# EasyEDA Pro project ProPrj_24王起源U202442553_2025-12-01.epro

# Schematic AI-Light原理图
Board Name: AI-Light; Create Date: 2025-11-24; Page Name: P1; Project Name: 24王起源U202442553; Schematic Name: AI-Light原理图; Update Date: 2025-11-24; Company: 嘉立创EDA; Page Size: A4; Version: V1.0
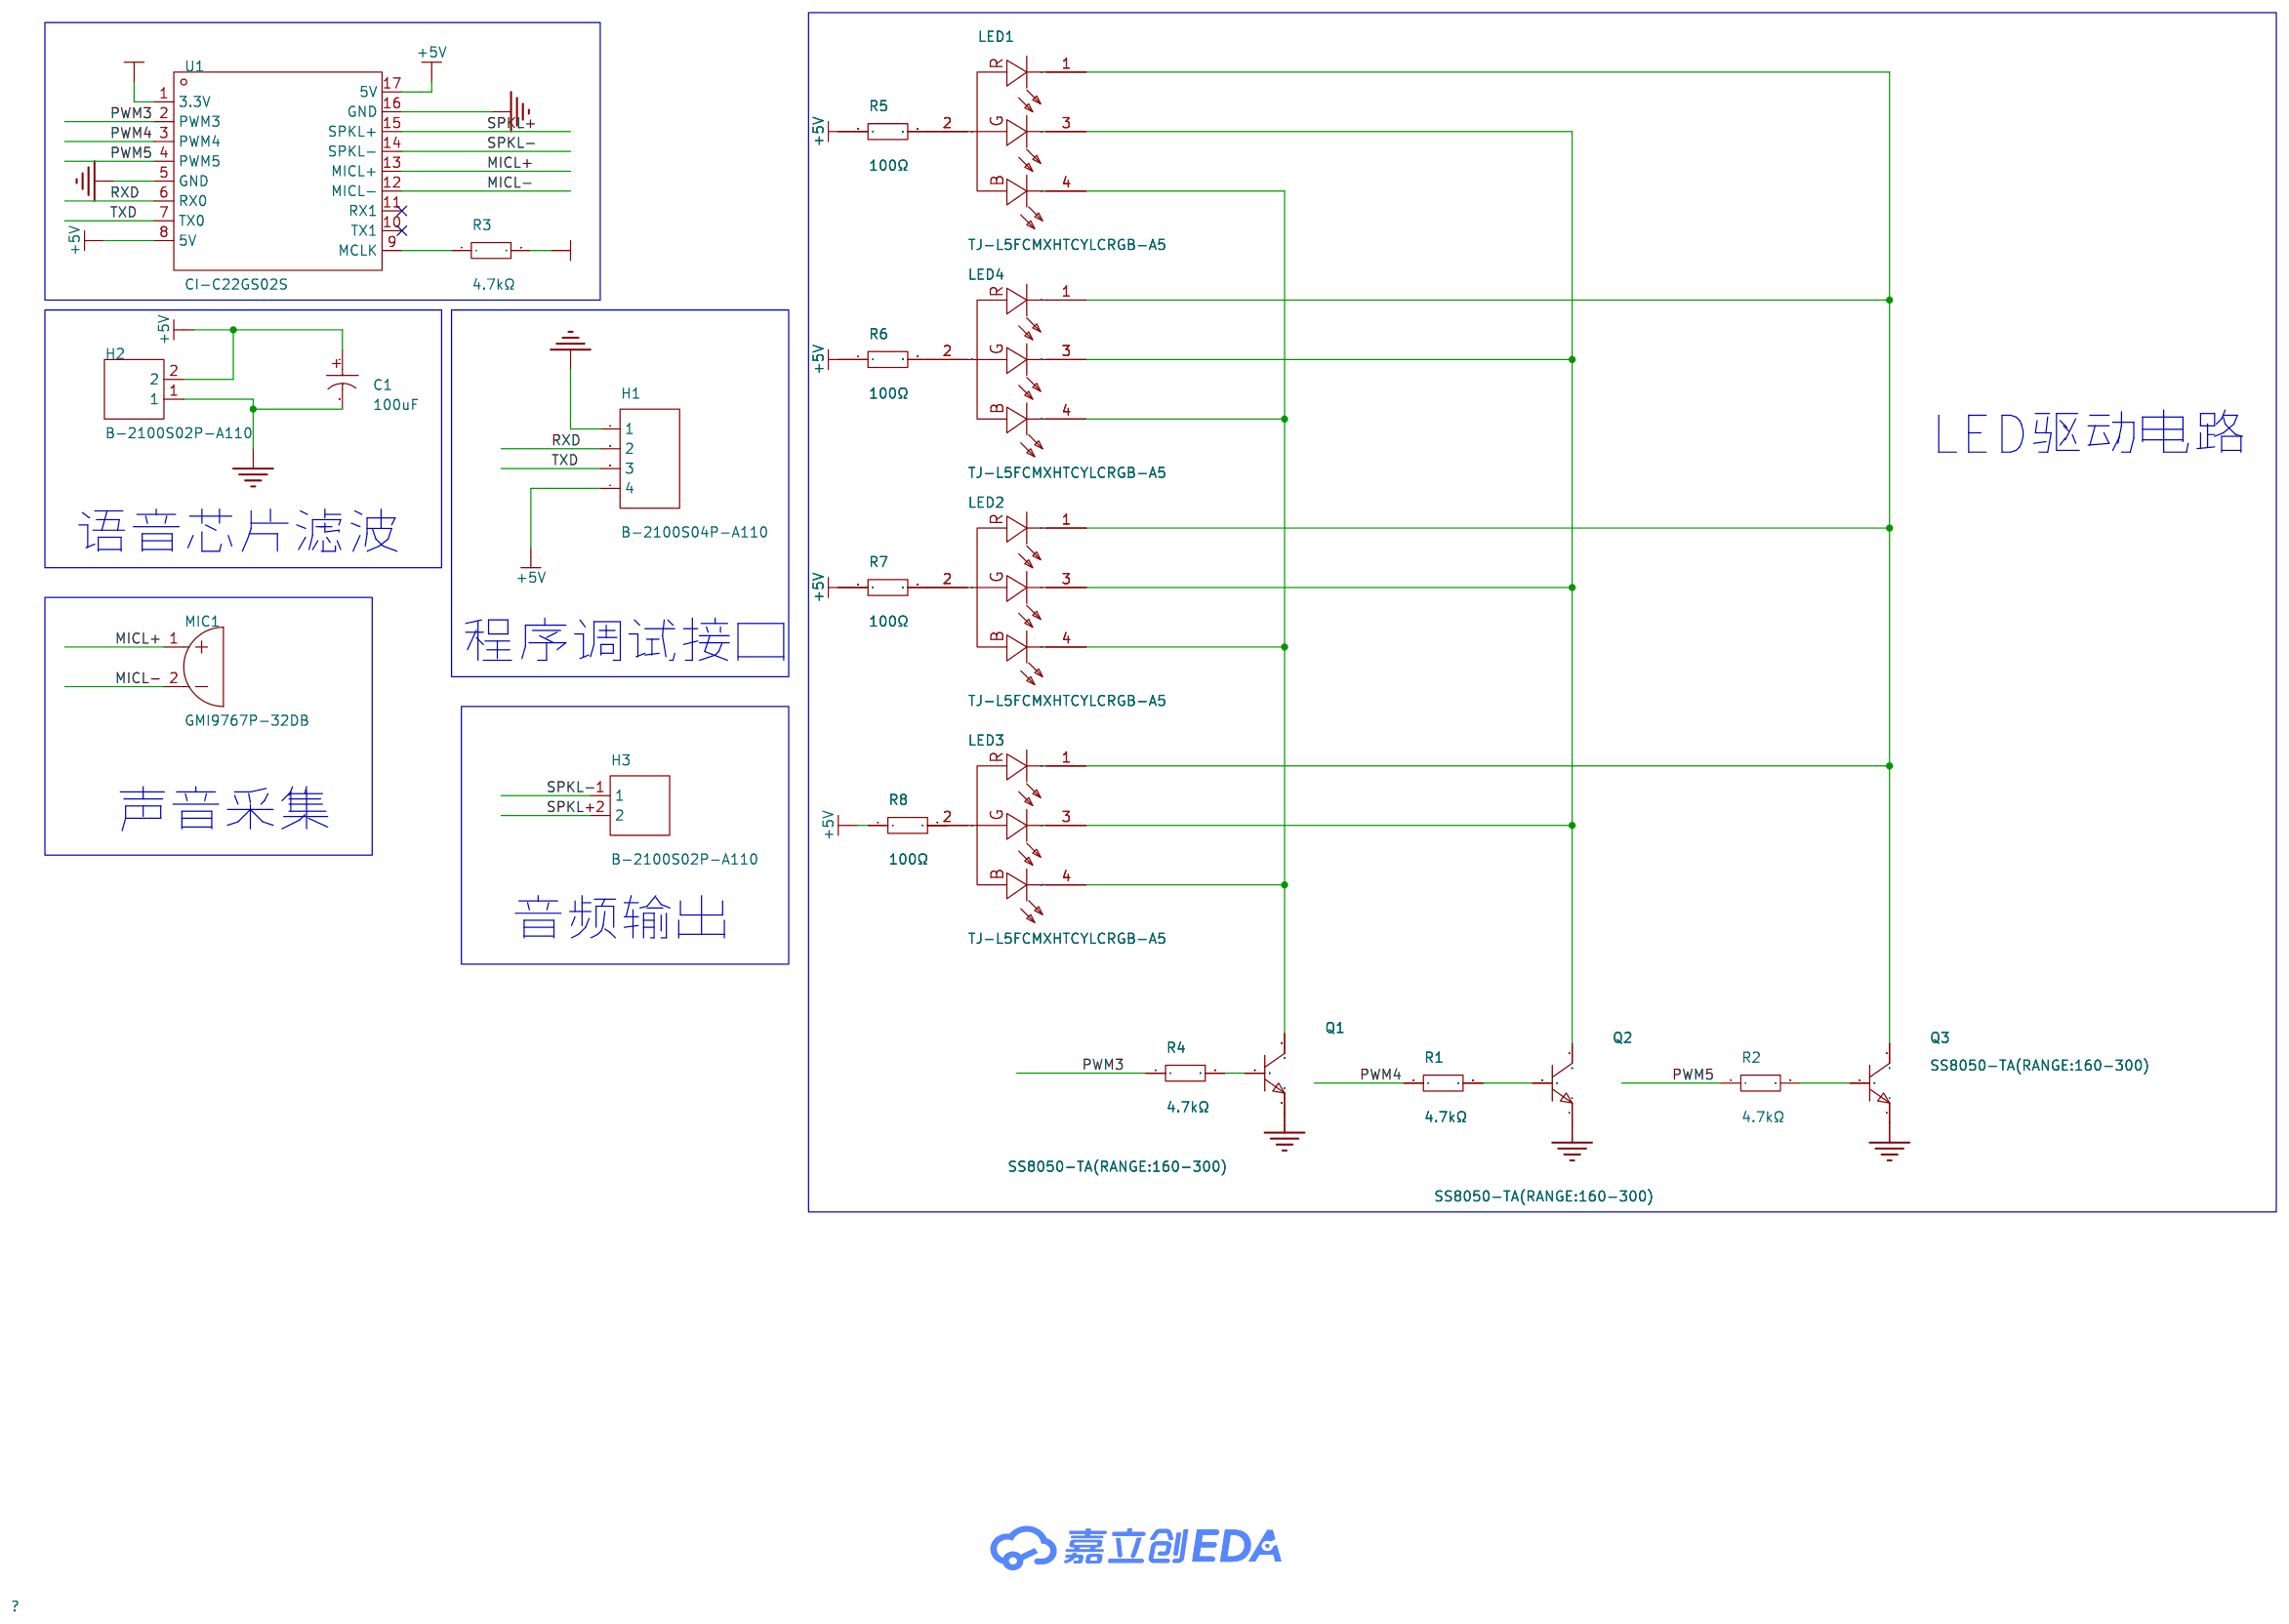
[diagram p0: schematic sheet]

## Parts
C1  100uF  [CAP-TH_BD5.0-P2.00-D0.8-FD]
H1  B-2100S04P-A110  [HDR-TH_4P-P2.54-V-M]
H2  B-2100S02P-A110  [HDR-TH_2P-P2.54-V-M-1]
H3  B-2100S02P-A110  [HDR-TH_2P-P2.54-V-M-1]
LED1  TJ-L5FCMXHTCYLCRGB-A5  [LED-TH_4P-BD5.8-P1.30]
LED2  TJ-L5FCMXHTCYLCRGB-A5  [LED-TH_4P-BD5.8-P1.30]
LED3  TJ-L5FCMXHTCYLCRGB-A5  [LED-TH_4P-BD5.8-P1.30]
LED4  TJ-L5FCMXHTCYLCRGB-A5  [LED-TH_4P-BD5.8-P1.30]
MIC1  GMI9767P-32DB  [MIC-TH_BD9.7-P2.54-D0.8-L-FD]
Q1  SS8050-TA(RANGE:160-300)  [TO-92-3_L4.8-W3.7-P2.54-L]
Q2  SS8050-TA(RANGE:160-300)  [TO-92-3_L4.8-W3.7-P2.54-L]
Q3  SS8050-TA(RANGE:160-300)  [TO-92-3_L4.8-W3.7-P2.54-L]
R1  4.7kΩ  [RES-TH_BD2.3-L6.5-P10.50-D0.5]
R2  4.7kΩ  [RES-TH_BD2.3-L6.5-P10.50-D0.5]
R3  4.7kΩ  [RES-TH_BD2.3-L6.5-P10.50-D0.5]
R4  4.7kΩ  [RES-TH_BD2.3-L6.5-P10.50-D0.5]
R5  100Ω  [RES-TH_BD3.3-L9.0-P13.00-D0.6]
R6  100Ω  [RES-TH_BD3.3-L9.0-P13.00-D0.6]
R7  100Ω  [RES-TH_BD3.3-L9.0-P13.00-D0.6]
R8  100Ω  [RES-TH_BD3.3-L9.0-P13.00-D0.6]
U1  CI-C22GS02S  [SMD-17_L20.0-W1.80-CI-C22GS02S]

## Library data of the parts
C1 = KM107M016D11RR0VH2FP0: 容值:100uF;精度:±20%;额定电压:16V;纹波电流:125mA@120Hz;等效串联电阻(ESR):-;; LCSC Part Name: 100uF ±20% 16V; Supplier Part: C43348; Manufacturer: Chengx(承兴); Supplier Footprint: 插件,D5xL11mm; JLCPCB Part Class: 扩展库; Datasheet: https://item.szlcsc.com/datasheet/KM107M016D11RR0VH2FP0/44339.html; Supplier: LCSC; Tolerance: ±20%; Voltage Rating: 16V; Ripple Current: 125mA@120Hz; Pin Spacing: 2mm; Diameter: 5mm; Height - Seated (Max): 11mm; Lifetime: 1000hrs@105℃
H1 = B-2100S04P-A110: 插针结构:1x4P;间距:2.54mm;行距:-;圆针/方针:-;安装方式:直插;排数:单排;总PIN位数:4P;额定电流:-;额定电压:-;配合针长度:6mm;塑高:2.54mm;端接针长度:3mm;触头材质:黄铜;触头镀层:-;工作温度:-40℃~+105℃;颜色:黑色;; LCSC Part Name: 1x4P 间距:2.54mm 直插; Supplier Part: C124378; Manufacturer: Ckmtw(灿科盟); Supplier Footprint: 插件,P=2.54mm; JLCPCB Part Class: 扩展库; Datasheet: https://item.szlcsc.com/datasheet/B-2100S04P-A110/125653.html; Supplier: LCSC; Pin Structure: 1x4P; Pitch: 2.54mm; Mounting Type: 直插; Number of Rows: 单排; Number of Pins: 4P; Length of Mating Pin: 6mm; Insulation Height: 2.54mm; Length of End Connection Pin: 3mm; Contact Material: 黄铜; Operating Temperature: -40℃~+105℃; Color: 黑色
H2 H3 = B-2100S02P-A110: 插针结构:1x2P;间距:2.54mm;行距:-;圆针/方针:-;安装方式:直插;排数:单排;总PIN位数:2P;额定电流:-;额定电压:-;配合针长度:6mm;塑高:2.54mm;端接针长度:3mm;触头材质:黄铜;触头镀层:-;工作温度:-40℃~+105℃;颜色:黑色;; LCSC Part Name: 1x2P 间距:2.54mm 直插; Supplier Part: C124375; Manufacturer: Ckmtw(灿科盟); Supplier Footprint: 插件,P=2.54mm; JLCPCB Part Class: 扩展库; Datasheet: https://item.szlcsc.com/datasheet/B-2100S02P-A110/125650.html; Supplier: LCSC; Pin Structure: 1x2P; Pitch: 2.54mm; Mounting Type: 直插; Number of Rows: 单排; Number of Pins: 2P; Length of Mating Pin: 6mm; Insulation Height: 2.54mm; Length of End Connection Pin: 3mm; Contact Material: 黄铜; Operating Temperature: -40℃~+105℃; Color: 黑色
LED1-LED4 = TJ-L5FCMXHTCYLCRGB-A5: F5草帽RGB,直插RGB,F5草帽三色RGB; LCSC Part Name: RGB三色; Supplier Part: C2837018; Manufacturer: TOGIALED(统佳); Supplier Footprint: 插件,D=5mm; JLCPCB Part Class: 扩展库; Datasheet: https://atta.szlcsc.com/upload/public/pdf/source/20210617/C2837018_8E26FA8363448FE2426644DEE2002080.pdf; Supplier: LCSC; Diode Configuration: 共阳极; Luminous Intensity: G:800mcd~1500mcd；B:200mcd~400mcd；R:200mcd~500mcd; Lens Color: 无色透明透镜; Forward Voltage: R:1.8V~2.4V；B:2.8V~3.4V；G:2.8V~3.4V; Operating Temperature: -20℃~+80℃
MIC1 = GMI9767P-32DB: 指向性:全指向;输出阻抗:2.2kΩ;信噪比:58dB;灵敏度:-32dB;; LCSC Part Name: 全指向φ9.7*6.7mm 1.5V-10V 灵敏度-32db 低阻抗 针脚; Supplier Part: C234013; Manufacturer: INGHAi(赢海); Supplier Footprint: 插件,D=9.7mm; JLCPCB Part Class: 扩展库; Datasheet: https://item.szlcsc.com/datasheet/GMI9767P-32DB/233795.html; Supplier: LCSC; Voltage - Supply: 4.5V; Current - Supply: 500uA; Direction: 全指向; Output Impedance: 2.2kΩ; S/N Ratio: 58dB; Sensitivity: -32dB; Diameter(φD): 9.7mm; Height: 6.7mm; Operating Temperature: -20℃~+60℃; Mounting Type: 插件
Q1-Q3 = SS8050-TA(RANGE:160-300): 晶体管类型:NPN;集电极电流(Ic):1.5A;集射极击穿电压(Vceo):25V;耗散功率(Pd):1W;直流电流增益(hFE):160@800mA,1V;; LCSC Part Name: hfe=160~300 NPN 电流:1.5A 电压:25V; Supplier Part: C80297; Manufacturer: CJ(江苏长电/长晶); Supplier Footprint: TO-92; JLCPCB Part Class: 扩展库; Datasheet: https://item.szlcsc.com/datasheet/SS8050-TA(RANGE%253A160-300)/81443.html; Supplier: LCSC; type: NPN; Current - Collector(Ic): 1.5A; Collector - Emitter Voltage VCEO: 25V; Pd - Power Dissipation: 1W; DC Current Gain: 160@800mA,1V; Transition frequency(fT): 100MHz; Current - Collector Cutoff: 100nA; Vce Saturation(VCE(sat)): 500mV; Operating Temperature: -55℃~+150℃
R1-R4 = MF1/4W-4.7KΩ±1% T: 电阻类型:金属膜电阻;阻值:4.7kΩ;精度:±1%;功率:250mW;温度系数:±100ppm/℃;; LCSC Part Name: 4.7kΩ ±1% 250mW 金属膜电阻 圆柱状直插; Supplier Part: C119339; Manufacturer: CCO(千志电子); Supplier Footprint: 插件,D2.3xL6.5mm; JLCPCB Part Class: 扩展库; Datasheet: https://item.szlcsc.com/datasheet/MF1%252F4W-4.7K%25CE%25A9%25C2%25B11%2525%2520T/120608.html; Supplier: LCSC; Type: 金属膜电阻; Tolerance: ±1%; Voltage-Supply(Max): 250V; Power(Watts): 250mW; Temperature Coefficient: ±100ppm/℃; Operating Temperature: -55℃~+155℃
R5-R8 = RN1/2W100ΩFT/BA1: 电阻类型:金属膜电阻;阻值:100Ω;精度:±1%;功率:500mW;温度系数:±50ppm/℃;; LCSC Part Name: 100Ω ±1% 500mW 金属膜电阻; Supplier Part: C385562; Manufacturer: Tyohm(幸亚电阻); Supplier Footprint: 插件,D3.3xL9.2mm; JLCPCB Part Class: 扩展库; Datasheet: https://item.szlcsc.com/datasheet/RN1%252F2W100%25CE%25A9FT%252FBA1/359409.html; Supplier: LCSC; Type: 金属膜电阻; Tolerance: ±1%; Voltage-Supply(Max): 350V; Power(Watts): 500mW; Temperature Coefficient: ±50ppm/℃
U1 = CI-C22GS02S: 长宽：18x20mm；带1路麦克风、1路喇叭和2路UART的接口、3路PWM接口。对外接口采用2排邮票孔和插针孔，方便采用回流贴片使用和焊接插针使用；支持离线语音识别（命令词条数：100条）; LCSC Part Name: CI1122单麦离线语音识别贴片模块; Supplier Part: C2759836; Manufacturer: Chiplntelli(启英泰伦); JLCPCB Part Class: 扩展库; Datasheet: https://item.szlcsc.com/datasheet/CI-C22GS02S/2879102.html; Supplier: LCSC

## Nets
3.3V: R3.2 U1.1(3.3V)
+5V: C1.1 H1.4 H2.2 R5.1 R6.1 R7.1 R8.1 U1.8(5V) U1.17(5V)
GND: C1.2 H1.1 H2.1 Q1.1(E) Q2.1(E) Q3.1(E) U1.5(GND) U1.16(GND)
MICL+: MIC1.1 U1.13(MICL+)
MICL-: MIC1.2 U1.12(MICL-)
PWM3: R4.1 U1.2(PWM3)
PWM4: R1.1 U1.3(PWM4)
PWM5: R2.1 U1.4(PWM5)
RXD: H1.2 U1.6(RX0)
SPKL+: H3.2 U1.15(SPKL+)
SPKL-: H3.1 U1.14(SPKL-)
TXD: H1.3 U1.7(TX0)
$1N639: LED1.2(CA) R5.2
$1N1634: R3.1 U1.9(MCLK)
$1N1900: LED4.2(CA) R6.2
$1N1902: LED2.2(CA) R7.2
$1N1904: LED3.2(CA) R8.2
$1N1908: Q1.2(B) R4.2
$1N1920: LED1.4(KB) LED2.4(KB) LED3.4(KB) LED4.4(KB) Q1.3(C)
$1N1972: Q2.2(B) R1.2
$1N2028: LED1.3(KG) LED2.3(KG) LED3.3(KG) LED4.3(KG) Q2.3(C)
$1N2078: Q3.2(B) R2.2
$1N2107: LED1.1(KR) LED2.1(KR) LED3.1(KR) LED4.1(KR) Q3.3(C)

Not connected (* = marked no-connect by the designer): U1 10(TX1)* 11(RX1)*

## Notes on the sheet
- LED驱动电路
- 语音芯片滤波
- 程序调试接口
- 声音采集
- 音频输出

# Board AI-Light-PCB
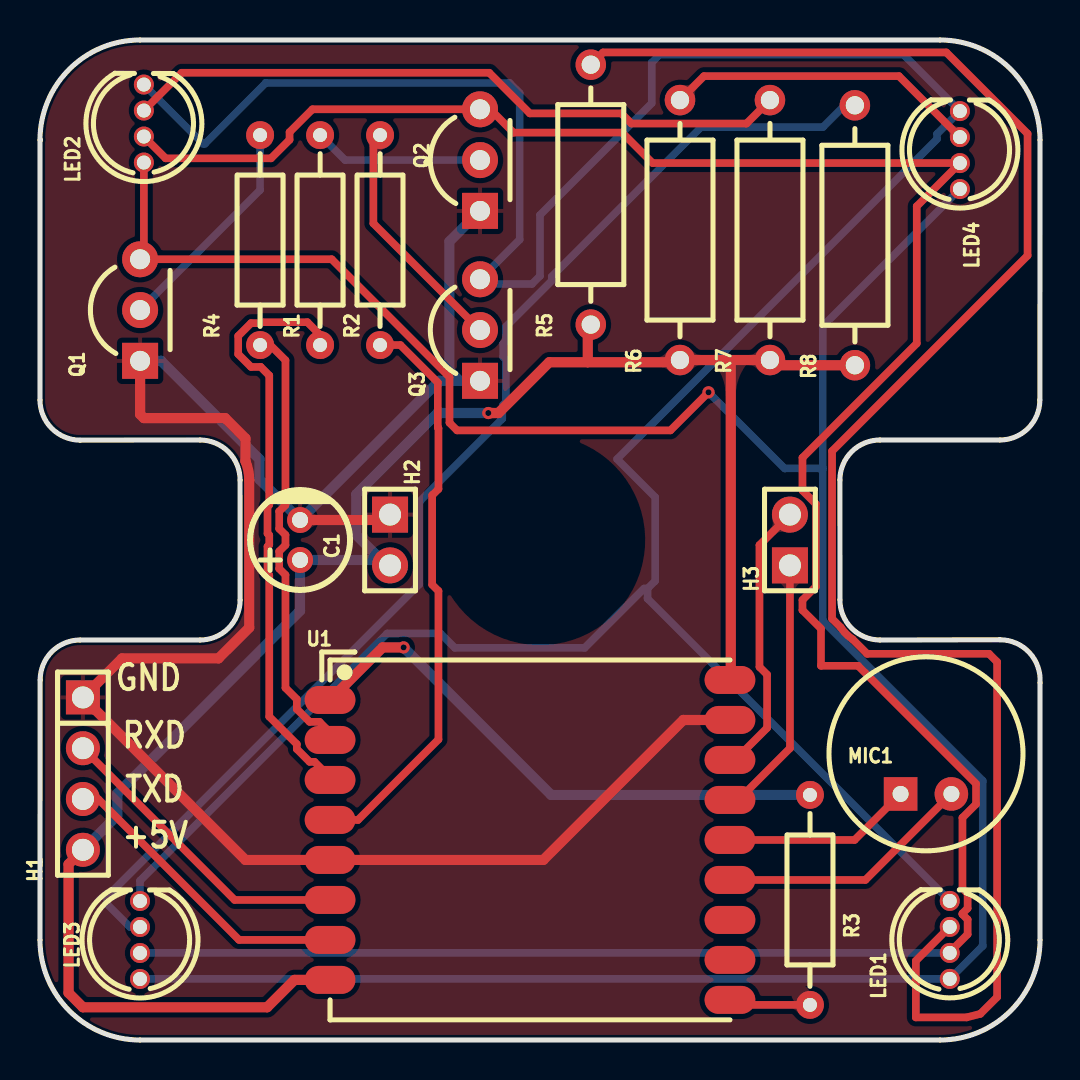
[diagram p1: board, top side]
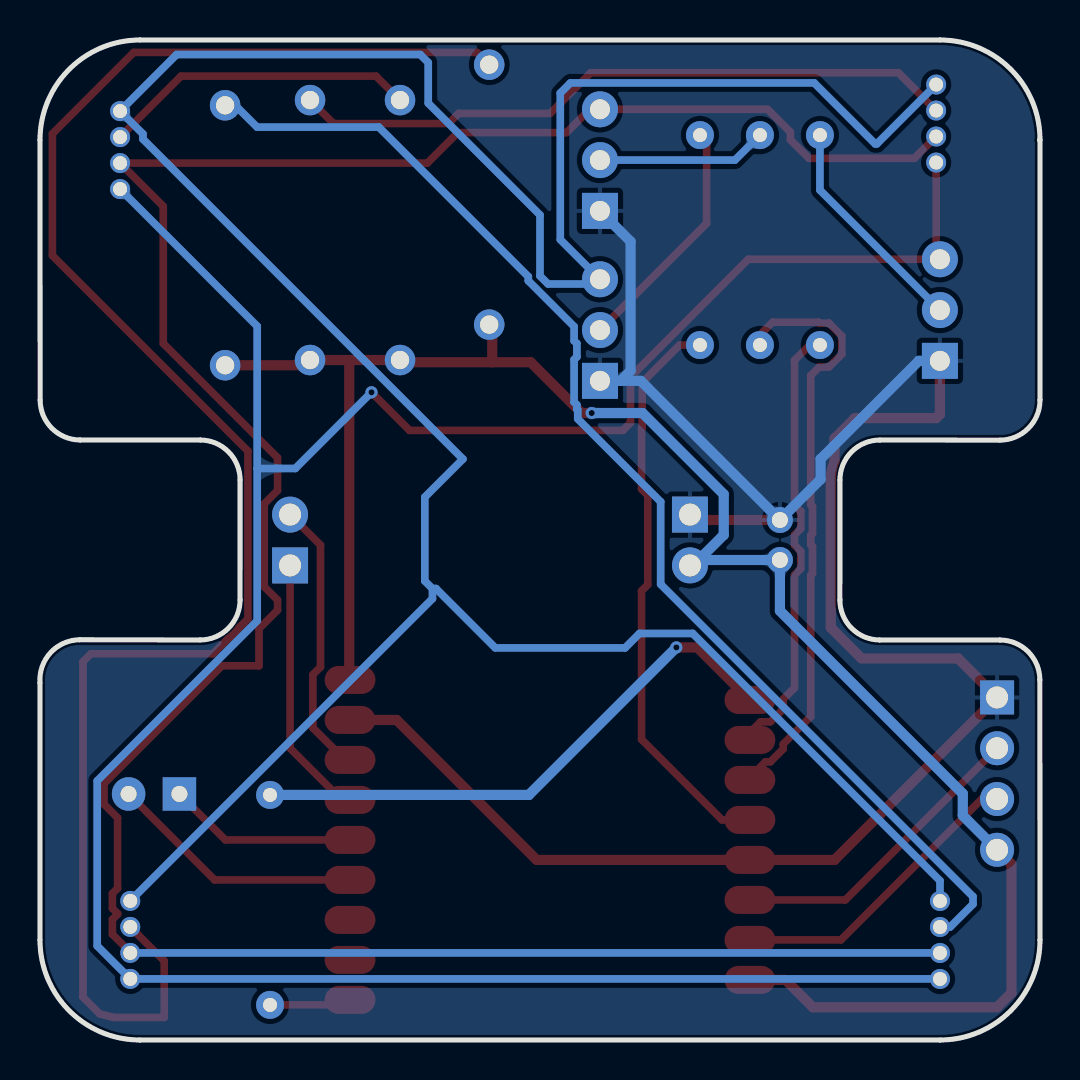
[diagram p2: board, bottom side, seen from below]

Outline 50.01 x 50.01 mm; copper layers: Top Layer, Bottom Layer. Coordinates in mm from the lower left corner of the outline.
Outline path: 0.02,45.03 arc(0.02,45.02) 0.03,45.01 ; 0,45.01 0,32.01 arc(0.59,30.59) 2.01,30 8.01,30.01 arc(9.42,29.42) 10.01,28 10.01,22.01 arc(9.42,20.59) 8.01,20 2.01,20 arc(0.59,19.42) 0.01,18.01 0,5 arc(1.46,1.46) 5,0 45.01,0 arc(48.55,1.46) 50.01,5 50.01,17.86 arc(49.48,19.38) 48.01,20.02 42.01,20.01 arc(40.59,20.59) 40.01,22.01 40.01,28.01 arc(40.59,29.42) 42.01,30.01 48.01,30.01 arc(49.42,30.59) 50.01,32.01 50.01,45.01 arc(48.55,48.55) 45.01,50.01 5,50.01 arc(1.46,48.55) 0,45.01
Stack: Top Layer 0.035mm / Dielectric1 1.51mm FR4 er 4.5 / Bottom Layer 0.035mm

## Design rules (mm)
template: 自定义配置
spacing copperThickness1oz (default): track to track 0.203, other pairs 0.203 to 0.203
spacing copperThickness2oz: track to track 0.203, other pairs 0.152 to 0.3
track width copperThickness1oz (default): min 0.254, default 0.381, max 0.508
track width copperThickness2oz: min 0.203, default 0.254, max 2.54
track width VCC and GND: min 0.254, default 0.508, max 0.508
differential pair differentialPair (default): width min 0.127, default 0.254, max 2.54; gap min 0.152, default 0.152
via viaSize (default): diameter min 0.5, default 0.61, max 10; hole min 0.3, default 0.305, max 6.3
net +5V uses VCC and GND
net GND uses VCC and GND
net 3.3V uses VCC and GND

## Placement (name value [footprint] x y rotation side)
C1  100uF  [CAP-TH_BD5.0-P2.00-D0.8-FD]  13.01 25.01 90 top
H1  B-2100S04P-A110  [HDR-TH_4P-P2.54-V-M]  2.15 13.32 270 top
H2  B-2100S02P-A110  [HDR-TH_2P-P2.54-V-M-1]  17.51 25.01 270 top
H3  B-2100S02P-A110  [HDR-TH_2P-P2.54-V-M-1]  37.51 25.01 90 top
LED1  TJ-L5FCMXHTCYLCRGB-A5  [LED-TH_4P-BD5.8-P1.30]  45.5 5.01 90 top
LED2  TJ-L5FCMXHTCYLCRGB-A5  [LED-TH_4P-BD5.8-P1.30]  5.19 45.83 90 top
LED3  TJ-L5FCMXHTCYLCRGB-A5  [LED-TH_4P-BD5.8-P1.30]  5 5 90 top
LED4  TJ-L5FCMXHTCYLCRGB-A5  [LED-TH_4P-BD5.8-P1.30]  46.01 44.51 90 top
MIC1  GMI9767P-32DB  [MIC-TH_BD9.7-P2.54-D0.8-L-FD]  44.31 12.31 0 top
Q1  SS8050-TA(RANGE:160-300)  [TO-92-3_L4.8-W3.7-P2.54-L]  5.01 36.51 90 top
Q2  SS8050-TA(RANGE:160-300)  [TO-92-3_L4.8-W3.7-P2.54-L]  22.01 44.01 90 top
Q3  SS8050-TA(RANGE:160-300)  [TO-92-3_L4.8-W3.7-P2.54-L]  22.01 35.51 90 top
R1  4.7kΩ  [RES-TH_BD2.3-L6.5-P10.50-D0.5]  14.01 40.01 90 top
R2  4.7kΩ  [RES-TH_BD2.3-L6.5-P10.50-D0.5]  17.01 40.01 90 top
R3  4.7kΩ  [RES-TH_BD2.3-L6.5-P10.50-D0.5]  38.51 7.01 90 top
R4  4.7kΩ  [RES-TH_BD2.3-L6.5-P10.50-D0.5]  11.01 40.01 90 top
R5  100Ω  [RES-TH_BD3.3-L9.0-P13.00-D0.6]  27.55 42.28 90 top
R6  100Ω  [RES-TH_BD3.3-L9.0-P13.00-D0.6]  32.01 40.51 90 top
R7  100Ω  [RES-TH_BD3.3-L9.0-P13.00-D0.6]  36.51 40.51 90 top
R8  100Ω  [RES-TH_BD3.3-L9.0-P13.00-D0.6]  40.75 40.25 90 top
U1  CI-C22GS02S  [SMD-17_L20.0-W1.80-CI-C22GS02S]  24.51 10.01 0 top

## Footprints (pads in the part's own frame, mm; a bottom-side part is the same pattern mirrored in y, then rotated)
CAP-TH_BD5.0-P2.00-D0.8-FD
  round 1.3 hole 0.8: 1(-1,0) 2(1,0)
HDR-TH_2P-P2.54-V-M-1
  rect 1.8x1.8 hole 1.1: 1(-1.27,0)
  round 1.8 hole 1.1: 2(1.27,0)
HDR-TH_4P-P2.54-V-M
  rect 1.7x1.7 hole 1.1: 1(-3.81,0)
  round 1.7 hole 1.1: 2(-1.27,0) 3(1.27,0) 4(3.81,0)
LED-TH_4P-BD5.8-P1.30
  round 1 hole 0.7: 1(1.95,0) 2(0.65,0) 3(-0.65,0) 4(-1.95,0)
MIC-TH_BD9.7-P2.54-D0.8-L-FD
  rect 1.677x1.677 hole 0.8: 1(-1.27,0)
  round 1.677 hole 0.8: 2(1.27,0)
RES-TH_BD2.3-L6.5-P10.50-D0.5
  round 1.4 hole 0.7: 1(-5.25,0) 2(5.25,0)
RES-TH_BD3.3-L9.0-P13.00-D0.6
  round 1.524 hole 0.914: 1(-6.5,0) 2(6.5,0)
SMD-17_L20.0-W1.80-CI-C22GS02S
  oval 2.54x1.4 smd: 1(-10,7) 2(-10,5) 3(-10,3) 4(-10,1) 5(-10,-1) 6(-10,-3) 7(-10,-5) 8(-10,-7) 9(10,-8) 10(10,-6) 11(10,-4) 12(10,-2) 13(10,0) 14(10,2) 15(10,4) 16(10,6) 17(10,8)
TO-92-3_L4.8-W3.7-P2.54-L
  rect 1.8x1.8 hole 1: 1(-2.54,0)
  round 1.8 hole 1: 2(0,0) 3(2.54,0)

## Nets
As in the schematic.

Pads without a net: U1 10 11

## Via types
v1: diameter 0.61, hole 0.305, Top Layer to Bottom Layer, 3 vias

## Routing (per net, layer and track width the routed paths; a pad name or vN(x,y) marks a point on that pad's centre or on a via; arc(x,y) is an arc through that point)
3.3V: length 28.1
  Top Layer w0.508: v1(18.19,19.63) 17.13,19.63 U1.1
  Bottom Layer w0.508: v1(18.19,19.63) 25.56,12.26 R3.2
+5V: length 94.6
  Top Layer w0.508: U1.17 34.55,18.05 34.55,34.01 ; R8.1 36.77,33.75 R7.1 34.55,34.01 ; 34.55,34.01 R6.1 31.9,33.9 27.4,33.9 ; 27.4,33.9 25.47,33.9 22.93,31.36 v1(22.42,31.36) ; 27.4,33.9 27.4,35.63 R5.1 ; U1.8 12.73,3.01 11.36,1.64 2.15,1.64 1.43,2.36 1.43,8.79 H1.4
  Bottom Layer w0.508: v1(22.42,31.36) 19.88,31.36 15.82,27.29 15.82,25.26 17.07,24.01 ; 17.07,24.01 17.34,23.74 H2.2 ; 17.07,24.01 C1.1 13.01,21.47 3.86,12.32 3.86,11.23 H1.4
GND: length 104.1
  Top Layer w0.508: Q1.1 5.01,31.29 5.19,31.1 9.26,31.1 10.27,30.09 10.27,28.95 arc(10.42,28.49) 10.46,28 10.46,20.62 8.93,19.09 4.1,19.09 H1.1 10.27,9.01 U1.5 25.17,9.01 32.17,16.01 U1.16 ; C1.2 17.24,26.01 H2.1
  Bottom Layer w0.508: 20.98,32.97 19.97,32.97 C1.2 10.97,28.04 10.97,29.05 6.06,33.97 Q1.1 ; 20.98,32.97 20.47,33.47 20.47,39.93 Q2.1 ; 20.98,32.97 Q3.1
MICL+: length 9.5
  Top Layer w0.381: MIC1.1 40.74,10.01 U1.13
MICL-: length 12.9
  Top Layer w0.381: U1.12 41.28,8.01 MIC1.2
PWM3: length 22.3
  Top Layer w0.381: U1.2 14.51,15.38 13.98,15.91 13.48,15.91 12.84,16.55 12.84,17.05 12.28,17.61 12.28,23.26 11.96,23.57 11.96,24.44 12.28,24.75 12.28,25.26 11.96,25.57 11.96,26.44 12.28,26.75 12.28,33.99 11.51,34.76 R4.1
PWM4: length 29.8
  Top Layer w0.381: R1.1 14.01,35.26 13.37,35.9 11.09,35.9 11.04,35.85 10.55,35.85 9.91,35.21 9.91,34.3 10.55,33.66 11.04,33.66 11.47,33.23 11.47,26.77 11.38,26.68 11.38,25.33 11.47,25.24 11.47,24.77 11.38,24.68 11.38,23.33 11.47,23.24 11.47,16.17 12.84,14.8 12.84,14.55 13.48,13.91 13.73,13.91 14.51,13.13 U1.3
PWM5: length 28.9
  Top Layer w0.381: U1.4 15.9,11.01 19.93,15.03 19.93,22.46 19.61,22.77 19.61,27.24 19.93,27.56 19.93,30.6 19.9,30.63 19.9,32.88 18.02,34.76 R2.1
RXD: length 15.5
  Top Layer w0.381: U1.6 9.73,7.01 H1.2
SPKL+: length 14
  Top Layer w0.381: U1.15 34.76,14.01 36.36,15.61 36.36,18.28 35.98,18.66 35.98,24.75 H3.2
SPKL-: length 13.2
  Top Layer w0.381: H3.1 37.51,14.59 35.22,12.31 34.81,12.31 U1.14
TXD: length 15.3
  Top Layer w0.381: U1.7 9.95,5.01 2.91,12.05 H1.3
$1N639: length 87.7
  Top Layer w0.381: LED1.2 43.8,3.96 43.8,1.13 46.34,1.13 47.03,1.31 47.87,2.15 47.87,18.91 47.46,19.31 41.37,19.31 40.64,20.04 arc(40.31,20.31) 40.04,20.64 39.61,21.07 39.61,29.45 49.39,39.23 49.39,45.33 45.33,49.39 28.16,49.39 R5.2
$1N1634: length 4.1
  Top Layer w0.381: R3.1 34.76,1.76 U1.9
$1N1900: length 15.8
  Top Layer w0.381: LED4.2 42.96,48.2 33.2,48.2 R6.2
$1N1902: length 33.6
  Top Layer w0.381: LED2.2 7.08,48.37 22.47,48.37 24.5,46.34 29.07,46.34 29.58,45.83 35.33,45.83 R7.2
$1N1904: length 61.5
  Bottom Layer w0.381: R8.2 40.25,46.75 39.16,45.66 33.07,45.66 25.59,38.18 25.59,37.97 23.3,35.68 23.3,34.97 23.16,34.83 23.16,34.17 23.3,34.03 23.3,31.9 23.16,31.77 23.16,31.56 23.12,31.52 23.12,31.07 18.97,26.92 18.97,22.8 3.35,7.18 3.35,6.79 4.49,5.65 LED3.2
$1N1908: length 11.2
  Bottom Layer w0.381: R4.2 11.01,42.51 Q1.2
$1N1920: length 133.1
  Top Layer w0.381: v1(33.43,32.39) 31.53,30.49 20.86,30.49 20.48,30.87 20.48,33.16 14.59,39.05 Q1.3 5.19,39.23 LED2.4
  Bottom Layer w0.381: LED4.4 39.15,35.7 39.15,28.58 ; v1(33.43,32.39) 37.24,28.58 39.15,28.58 ; 5.01,3.06 LED1.4 47.15,4.71 47.15,12.96 39.15,20.96 39.15,28.58
$1N1972: length 8.5
  Bottom Layer w0.381: Q2.2 15.26,44.01 R1.2
$1N2028: length 133.1
  Top Layer w0.381: LED2.3 6.28,44.09 11.55,44.09 12.48,45.02 12.48,45.4 13.62,46.55 Q2.3 22.51,46.55 23.68,45.38 29.12,45.38 30.64,43.86 LED4.3 43.85,41.7 43.85,34.84 38.13,29.12 38.13,27.48 38.8,26.81 38.8,22.67 38.13,22.01 38.13,21.5 39.06,20.57 39.06,18.72 40.91,18.72 46.81,12.82 46.81,11.8 46.13,11.12 46.13,7.59 46.39,7.33 46.39,6.59 46.13,6.33 46.13,6.29 46.39,6.03 46.39,5.29 45.5,4.39 LED1.3
  Bottom Layer w0.381: LED1.3 5.01,4.36
$1N2078: length 12.1
  Top Layer w0.381: Q3.2 16.67,40.84 16.67,44.92 R2.2
$1N2107: length 151.5
  Bottom Layer w0.381: LED1.1 30.39,22.07 30.39,22.58 ; 30.39,22.58 30.77,22.96 30.77,27.15 28.86,29.05 44.86,45.06 44.86,45.31 LED4.1 43.18,49.29 31,49.29 30.59,48.88 30.59,46.85 25.01,41.26 25.01,38.21 24.6,37.81 22.24,37.81 Q3.3 23.99,40.03 23.99,47.36 23.48,47.87 11.29,47.87 8.24,44.82 8.16,44.82 LED2.1 ; 30.39,22.58 30.21,22.58 27.24,19.61 20.75,19.61 20.03,20.33 17.37,20.33 5,7.97 LED3.1

## Copper pours and planes (outline as drawn; the poured copper is in the pictures)
GND on Top Layer: -1.92,50.91 51.42,50.91 51.42,-0.39 -1.92,-0.39
GND on Bottom Layer: -1.41,51.42 51.42,51.42 51.42,-1.41 -1.41,-1.41

Small or netless copper shapes (teardrops, artwork), in the pictures only: 13 on Top Layer, 10 on Bottom Layer

## Text on the board
Top Silkscreen Layer: GND | RXD | +5V | TXD
